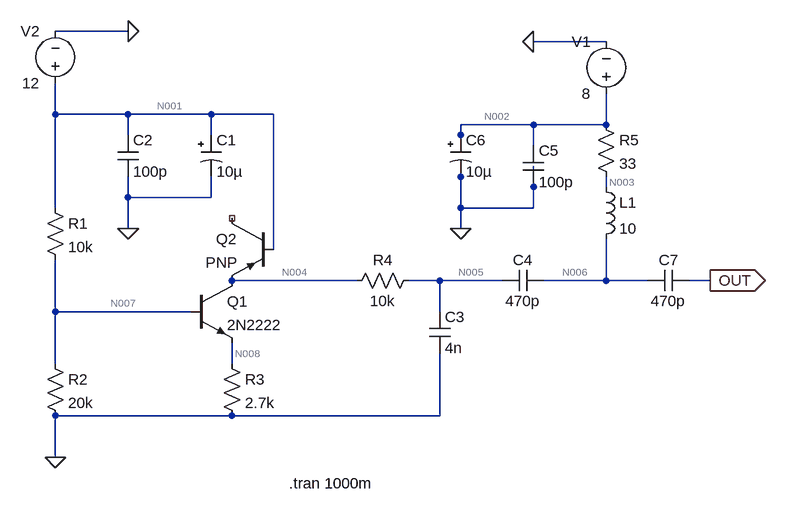
[diagram p0: schematic WhiteNoiseGenerator.asc]
WhiteNoiseGenerator.asc, the LTspice schematic file:
Version 4
SHEET 1 1660 712
WIRE 544 0 432 0
WIRE 1280 16 1168 16
WIRE 432 128 432 80
WIRE 544 128 432 128
WIRE 672 128 544 128
WIRE 768 128 672 128
WIRE 1168 144 1056 144
WIRE 1280 144 1280 96
WIRE 1280 144 1168 144
WIRE 544 160 544 128
WIRE 672 160 672 128
WIRE 1056 160 1056 144
WIRE 1056 176 1056 160
WIRE 1168 176 1168 144
WIRE 1056 224 1056 208
WIRE 1168 240 1168 208
WIRE 1280 240 1280 224
WIRE 544 256 544 224
WIRE 672 256 672 224
WIRE 672 256 544 256
WIRE 432 272 432 128
WIRE 1056 272 1056 224
WIRE 1168 272 1168 240
WIRE 1168 272 1056 272
WIRE 544 304 544 256
WIRE 1056 304 1056 272
WIRE 768 336 768 128
WIRE 896 384 704 384
WIRE 1024 384 976 384
WIRE 1120 384 1024 384
WIRE 1280 384 1280 320
WIRE 1280 384 1184 384
WIRE 1344 384 1280 384
WIRE 1440 384 1408 384
WIRE 432 432 432 352
WIRE 640 432 432 432
WIRE 1024 432 1024 384
WIRE 432 512 432 432
WIRE 704 512 704 480
WIRE 704 592 432 592
WIRE 1024 592 1024 496
WIRE 1024 592 704 592
WIRE 432 656 432 592
FLAG 432 656 0
FLAG 544 304 0
FLAG 1056 304 0
FLAG 544 0 0
FLAG 1168 16 0
FLAG 1440 384 OUT
IOPIN 1440 384 Out
SYMBOL cap 528 160 R0
SYMATTR InstName C2
SYMATTR Value 100p
SYMBOL res 416 256 R0
SYMATTR InstName R1
SYMATTR Value 10k
SYMBOL res 416 496 R0
SYMATTR InstName R2
SYMATTR Value 20k
SYMBOL res 688 496 R0
SYMATTR InstName R3
SYMATTR Value 2.7k
SYMBOL npn 640 384 R0
SYMATTR InstName Q1
SYMATTR Value 2N2222
SYMBOL pnp 768 288 M0
SYMATTR InstName Q2
SYMBOL res 992 368 R90
WINDOW 0 0 56 VBottom 2
WINDOW 3 32 56 VTop 2
SYMATTR InstName R4
SYMATTR Value 10k
SYMBOL cap 1008 432 R0
SYMATTR InstName C3
SYMATTR Value 4n
SYMBOL cap 1184 368 R90
WINDOW 0 0 32 VBottom 2
WINDOW 3 32 32 VTop 2
SYMATTR InstName C4
SYMATTR Value 470p
SYMBOL ind 1264 224 R0
SYMATTR InstName L1
SYMATTR Value 10
SYMBOL cap 1152 176 R0
SYMATTR InstName C5
SYMATTR Value 100p
SYMBOL res 1264 128 R0
SYMATTR InstName R5
SYMATTR Value 33
SYMBOL polcap 1040 160 R0
WINDOW 3 24 56 Left 2
SYMATTR InstName C6
SYMATTR Value 10µ
SYMATTR Description Capacitor
SYMATTR Type cap
SYMATTR SpiceLine V=12.5 Irms=2.21565 Rser=0.055 Lser=0 mfg="KEMET" pn="A700V106M12RATE055" type="Al electrolytic"
SYMBOL polcap 656 160 R0
WINDOW 3 24 56 Left 2
SYMATTR InstName C1
SYMATTR Value 10µ
SYMATTR Description Capacitor
SYMATTR Type cap
SYMATTR SpiceLine V=12.5 Irms=2.12132 Rser=0.06 Lser=0 mfg="KEMET" pn="A700V106M12RATE060" type="Al electrolytic"
SYMBOL voltage 1280 112 R180
WINDOW 0 24 96 Left 2
WINDOW 3 24 16 Left 2
WINDOW 123 0 0 Left 0
WINDOW 39 0 0 Left 0
SYMATTR InstName V1
SYMATTR Value 8
SYMBOL voltage 432 96 R180
WINDOW 0 24 96 Left 2
WINDOW 3 24 16 Left 2
WINDOW 123 0 0 Left 0
WINDOW 39 0 0 Left 0
SYMATTR InstName V2
SYMATTR Value 12
SYMBOL cap 1408 368 R90
WINDOW 0 0 32 VBottom 2
WINDOW 3 32 32 VTop 2
SYMATTR InstName C7
SYMATTR Value 470p
TEXT 792 696 Left 2 !.tran 1000m

The netlist it stands for:
* WhiteNoiseGenerator.asc
C2 N001 0 100p
R1 N001 N007 10k
R2 N007 0 20k
R3 N008 0 2.7k
Q1 N004 N007 N008 0 2N2222
Q2 NC_01 N001 N004 0 PNP
R4 N005 N004 10k
C3 N005 0 4n
C4 N006 N005 470p
L1 N003 N006 10
C5 N002 0 100p
R5 N002 N003 33
C6 N002 0 10µ V=12.5 Irms=2.21565 Rser=0.055 Lser=0 mfg="KEMET" pn="A700V106M12RATE055" type="Al electrolytic"
C1 N001 0 10µ V=12.5 Irms=2.12132 Rser=0.06 Lser=0 mfg="KEMET" pn="A700V106M12RATE060" type="Al electrolytic"
V1 N002 0 8
V2 N001 0 12
C7 OUT N006 470p
.model NPN NPN
.model PNP PNP
.lib standard.bjt
.tran 1000m
.backanno
.end

* Results of the author's LTspice run, read from the files saved beside the schematic
* Operating Point, zero values left out:
*   V(n001) = 12 V
*   V(n007) = 2.799 V
*   V(n008) = 2.107 V
*   V(n004) = 2.114 V
*   V(n005) = 2.114 V
*   V(n006) = 8 V
*   V(n003) = 8 V
*   V(n002) = 8 V
*   Ib(Q2) = 9.886 pA
*   Ie(Q2) = -9.886 pA
*   Ic(Q1) = 9.887 pA
*   Ib(Q1) = 780.2 µA
*   Ie(Q1) = -780.2 µA
*   I(R3) = 780.2 µA
*   I(R2) = 139.9 µA
*   I(R1) = 920.1 µA
*   I(V2) = -920.1 µA
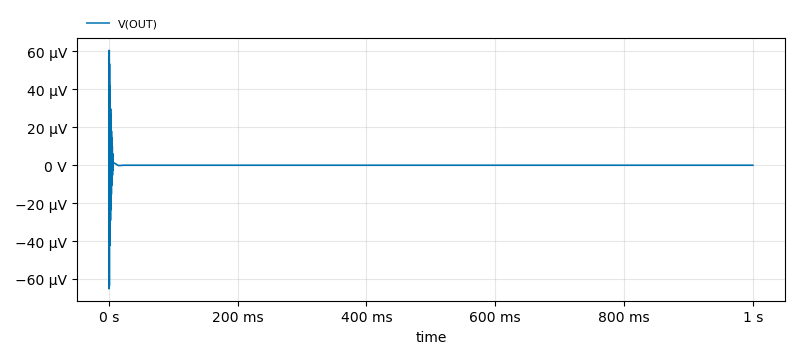
[diagram p1: Transient Analysis of WhiteNoiseGenerator.asc, plotted from the saved traces]
* Transient Analysis, 1 run:
*   V(OUT): min -65.18 µV, max 60.59 µV, average 10.91 nV, rms 2.049 µV, last 3.772 nV